# Altium schematic sheet MCU_STM32.SchDoc
size A4
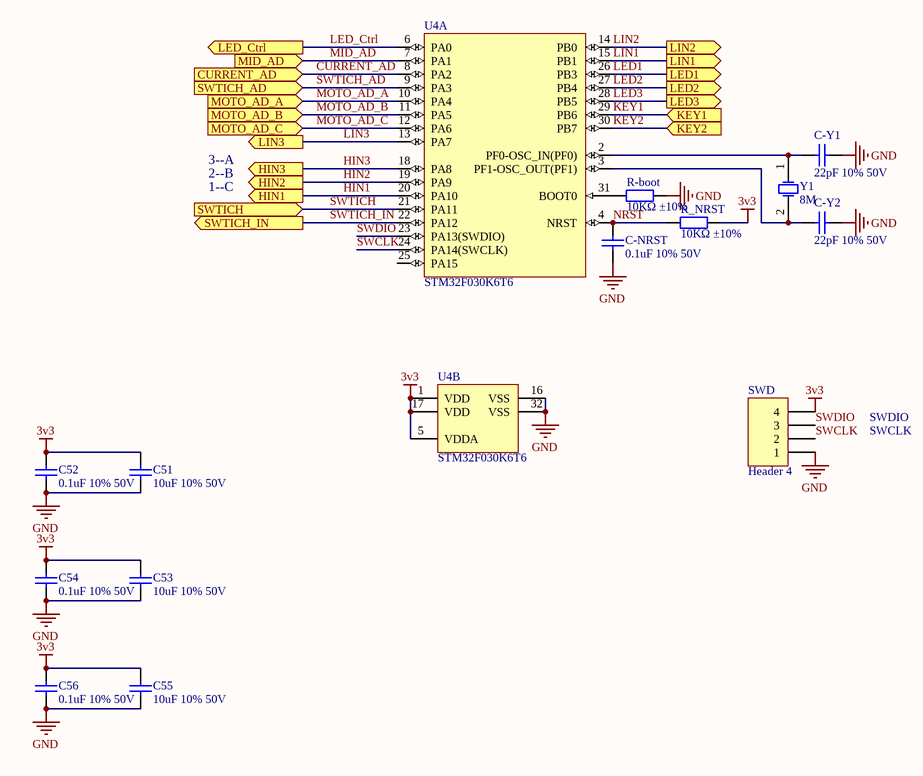
[diagram p0: MCU_STM32.SchDoc]

## Parts
C51  10uF 10% 50V  [0805_C]
C52  0.1uF 10% 50V  [0603_C]
C53  10uF 10% 50V  [0805_C]
C54  0.1uF 10% 50V  [0603_C]
C55  10uF 10% 50V  [0805_C]
C56  0.1uF 10% 50V  [0603_C]
C-NRST  0.1uF 10% 50V  [0603_C]
C-Y1  22pF 10% 50V  [0603_C]
C-Y2  22pF 10% 50V  [0603_C]
R-boot  10KΩ ±10%  [0603_R]
R_NRST  10KΩ ±10%  [0603_R]
SWD  Header 4  [FPC_1.25_4P]
U4  STM32F030K6T6  [STM-LQFP32_M]  (parts A,B of 2)
Y1  8M  [XTAL]

## Ports
CURRENT_AD (in), HIN1 (out), HIN2 (out), HIN3 (out), KEY1 (in), KEY2 (in), LED1 (out), LED2 (out), LED3 (out), LED_Ctrl (out), LIN1 (out), LIN2 (out), LIN3 (out), MID_AD (in), MOTO_AD_A (in), MOTO_AD_B (in), MOTO_AD_C (in), SWTICH (in), SWTICH_AD (in), SWTICH_IN (out)

## Nets
3v3: C51.2 C52.2 C53.2 C54.2 C55.2 C56.2 R_NRST.1 SWD.4 U4.1(VDD) U4.5(VDDA) U4.17(VDD)
GND: C51.1 C52.1 C53.1 C54.1 C55.1 C56.1 C-NRST.1 C-Y1.1 C-Y2.1 R-boot.1 SWD.1 U4.16(VSS) U4.32(VSS)
CURRENT_AD: U4.8(PA2) ; port CURRENT_AD
HIN1: U4.20(PA10) ; port HIN1
HIN2: U4.19(PA9) ; port HIN2
HIN3: U4.18(PA8) ; port HIN3
KEY1: U4.29(PB6) ; port KEY1
KEY2: U4.30(PB7) ; port KEY2
LED1: U4.26(PB3) ; port LED1
LED2: U4.27(PB4) ; port LED2
LED3: U4.28(PB5) ; port LED3
LED_Ctrl: U4.6(PA0) ; port LED_Ctrl
LIN1: U4.15(PB1) ; port LIN1
LIN2: U4.14(PB0) ; port LIN2
LIN3: U4.13(PA7) ; port LIN3
MID_AD: U4.7(PA1) ; port MID_AD
MOTO_AD_A: U4.10(PA4) ; port MOTO_AD_A
MOTO_AD_B: U4.11(PA5) ; port MOTO_AD_B
MOTO_AD_C: U4.12(PA6) ; port MOTO_AD_C
NRST: C-NRST.2 R_NRST.2 U4.4(NRST)
SWCLK: SWD.2 U4.24(PA14(SWCLK))
SWDIO: SWD.3 U4.23(PA13(SWDIO))
SWTICH: U4.21(PA11) ; port SWTICH
SWTICH_AD: U4.9(PA3) ; port SWTICH_AD
SWTICH_IN: U4.22(PA12) ; port SWTICH_IN
NetC-Y1_2: C-Y1.2 U4.2(PF0-OSC_IN(PF0)) Y1.1(OSC1)
NetC-Y2_2: C-Y2.2 U4.3(PF1-OSC_OUT(PF1)) Y1.2(OSC2)
NetR-boot_2: R-boot.2 U4.31(BOOT0)

Not connected (* = marked no-connect by the designer): U4 25(PA15)

## Notes on the sheet
- 3--A
- 2--B
- 1--C
- SWDIO
- SWCLK

## Library data of the parts
C51 C53 C55 = 0805 1uF (105) 10% 50V: 贴片电容; ComponentLink1Description: 供应商链接; ComponentLink1URL: http://www.szlcsc.com/product/details_29074.html; Package: 0805; Supplier: LC; SuppliersPartNumber: C28323
C52 C54 C56 C-NRST C-Y1 C-Y2 = 0603 4.7uF (475) 10% 16V: 贴片电容; ComponentLink1Description: 供应商链接; ComponentLink1URL: http://www.szlcsc.com/product/details_20375.html; Package: 0603; Supplier: LC; SuppliersPartNumber: C19666
R-boot R_NRST = 0603 2.2Ω (2R20) 1%: 贴片电阻; ComponentLink1Description: 供应商链接; ComponentLink1URL: http://www.szlcsc.com/product/details_23666.html; Package: 0603; Supplier: LC; SuppliersPartNumber: C22939
SWD = Header 4: Header, 4-Pin; LatestRevisionDate: 17-Jul-2002; LatestRevisionNote: Re-released for DXP Platform.; Publisher: Altium Limited
U4 = MC-ARM-STM32F030-SQ32
Y1 = XTAL: Crystal Oscillator; Published: 8-Jun-2000; LatestRevisionDate: 17-Jul-2002; LatestRevisionNote: Re-released for DXP Platform.; PackageReference: R38; Publisher: Altium Limited; PackageDescription: Crystal, Thru-Hole; 2 Leads; Body 3.1 x 8.2 mm (Dia.xH)